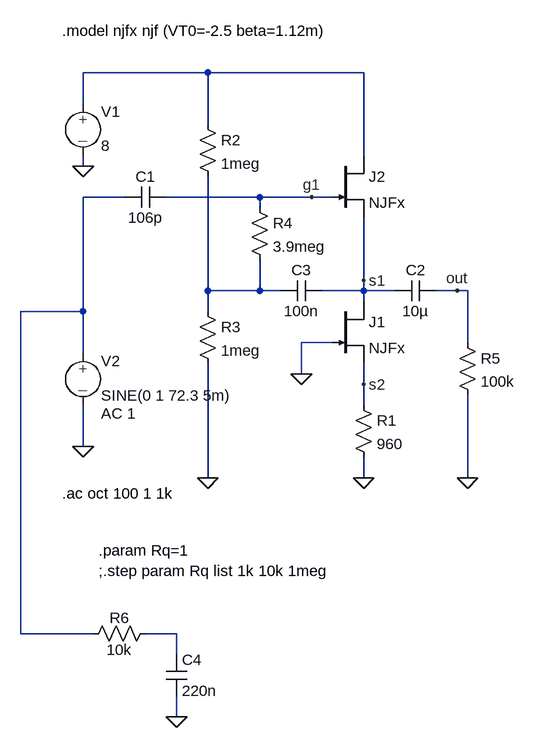
[diagram p0: schematic klausur_ws11_12_bootstrap.asc]
klausur_ws11_12_bootstrap.asc, the LTspice schematic file:
Version 4
SHEET 1 880 868
WIRE 16 -144 -176 -144
WIRE 256 -144 16 -144
WIRE -176 -96 -176 -144
WIRE 16 -64 16 -144
WIRE 256 -16 256 -144
WIRE -176 0 -176 -16
WIRE -112 48 -176 48
WIRE 96 48 -48 48
WIRE 176 48 96 48
WIRE 208 48 176 48
WIRE 96 64 96 48
WIRE 256 176 256 80
WIRE 16 192 16 16
WIRE 96 192 96 144
WIRE 96 192 16 192
WIRE 128 192 96 192
WIRE 256 192 256 176
WIRE 256 192 192 192
WIRE 304 192 256 192
WIRE 400 192 368 192
WIRE 416 192 400 192
WIRE 256 208 256 192
WIRE -176 224 -176 48
WIRE -176 224 -272 224
WIRE 16 224 16 192
WIRE 208 272 160 272
WIRE 416 272 416 192
WIRE -176 288 -176 224
WIRE 160 320 160 272
WIRE 256 336 256 304
WIRE 256 368 256 336
WIRE -176 432 -176 368
WIRE 16 480 16 304
WIRE 256 480 256 448
WIRE 416 480 416 352
WIRE -272 720 -272 224
WIRE -160 720 -272 720
WIRE -32 720 -80 720
WIRE -32 752 -32 720
WIRE -32 848 -32 816
FLAG 160 320 0
FLAG 256 480 0
FLAG 16 480 0
FLAG -176 432 0
FLAG -176 0 0
FLAG 256 176 s1
FLAG 176 48 g1
FLAG 256 336 s2
FLAG 416 480 0
FLAG 400 192 out
FLAG -32 848 0
SYMBOL source-V -176 -112 R0
WINDOW 123 0 0 Left 0
WINDOW 39 0 0 Left 0
SYMATTR InstName V1
SYMATTR Value 8
SYMBOL res 240 352 R0
SYMATTR InstName R1
SYMATTR Value 960
SYMBOL EIT_Semiconductors\\njf 208 208 R0
SYMATTR InstName J1
SYMATTR Value NJFx
SYMBOL EIT_Semiconductors\\njf 208 -16 R0
SYMATTR InstName J2
SYMATTR Value NJFx
SYMBOL res 0 -80 R0
SYMATTR InstName R2
SYMATTR Value 1meg
SYMBOL res 0 208 R0
SYMATTR InstName R3
SYMATTR Value 1meg
SYMBOL cap -48 32 R90
WINDOW 0 0 32 VBottom 0
WINDOW 3 32 32 VTop 0
SYMATTR InstName C1
SYMATTR Value 106p
SYMBOL cap 368 176 R90
WINDOW 0 0 32 VBottom 0
WINDOW 3 32 32 VTop 0
SYMATTR InstName C2
SYMATTR Value 10µ
SYMBOL cap 192 176 R90
WINDOW 0 0 32 VBottom 0
WINDOW 3 32 32 VTop 0
SYMATTR InstName C3
SYMATTR Value 100n
SYMBOL res 80 48 R0
SYMATTR InstName R4
SYMATTR Value 3.9meg
SYMBOL res 400 256 R0
SYMATTR InstName R5
SYMATTR Value 100k
SYMBOL source-V -176 272 R0
WINDOW 123 28 109 Left 0
WINDOW 39 25 133 Left 0
SYMATTR Value2 AC 1
SYMATTR InstName V2
SYMATTR Value SINE(0 1 72.3 5m)
SYMBOL res -64 704 R90
WINDOW 0 7 56 VBottom 0
WINDOW 3 25 56 VTop 0
SYMATTR InstName R6
SYMATTR Value 10k
SYMBOL cap -48 752 R0
SYMATTR InstName C4
SYMATTR Value 220n
TEXT -208 -208 Left 0 !.model njfx njf (VT0=-2.5 beta=1.12m)
TEXT -208 504 Left 0 !.ac oct 100 1 1k
TEXT -152 592 Left 0 !.param Rq=1\n;.step param Rq list 1k 10k 1meg

The netlist it stands for:
* klausur_ws11_12_bootstrap.asc
V1 N001 0 8
R1 s2 0 960
J1 s1 0 s2 NJFx
J2 N001 g1 s1 NJFx
R2 N001 N003 1meg
R3 N003 0 1meg
C1 g1 N002 106p
C2 out s1 10µ
C3 s1 N003 100n
R4 g1 N003 3.9meg
R5 out 0 100k
V2 N002 0 SINE(0 1 72.3 5m) AC 1
R6 N004 N002 10k
C4 N004 0 220n
.model NJF NJF
.model PJF PJF
.lib standard.jft
.model njfx njf (VT0=-2.5 beta=1.12m)
.ac oct 100 1 1k
.param Rq=1
;.step param Rq list 1k 10k 1meg
.backanno
.end